# Altium schematic sheet CAN bus XL2515.SchDoc
size A4; SheetNumber: 8; SheetTotal: 12
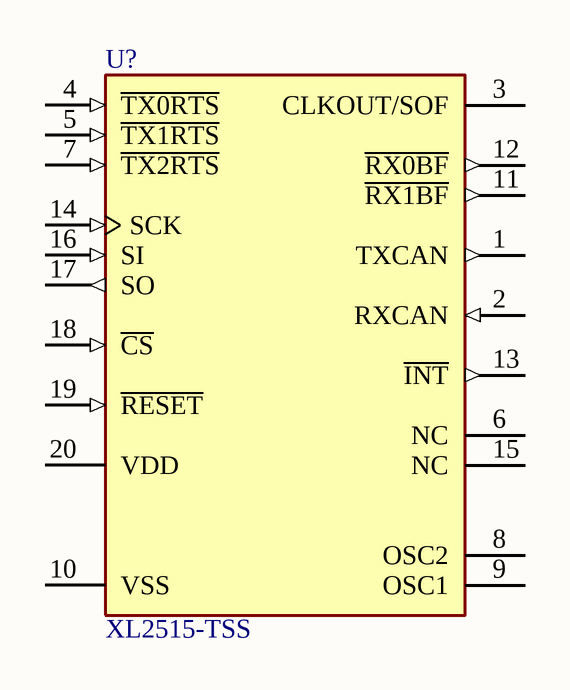
[diagram p0: CAN bus XL2515.SchDoc]

## Parts
U?  XL2515-TSS  [TSOP65P640X110-20N]

## Nets

Not connected (* = marked no-connect by the designer): U? 1(TXCAN) 2(RXCAN) 3(CLKOUT/SOF) 4(~{TX0RTS}) 5(~{TX1RTS}) 6(NC) 7(~{TX2RTS}) 8(OSC2) 9(OSC1) 10(VSS) 11(~{RX1BF}) 12(~{RX0BF}) 13(~{INT}) 14(SCK) 15(NC) 16(SI) 17(SO) 18(~{CS}) 19(~{RESET}) 20(VDD)

## Library data of the parts
U? = XL2515-TSS: IC CAN CTLR W/SPI 2.0B 20-QFN; Manufacturer: XINLUDA; Part Number: XL2515-TSS; ComponentLink1URL: https://datasheet.lcsc.com/lcsc/2012081507_XINLUDA-XL2515-TSS_C609745.pdf; ComponentLink1Description: Datasheet; Package: TSSOP-20; Part Status: Active